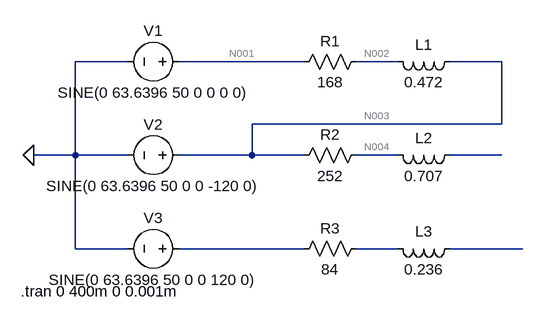
[diagram p0: schematic scheme4.asc]
scheme4.asc, the LTspice schematic file:
Version 4
SHEET 1 964 680
WIRE 352 0 272 0
WIRE 624 0 432 0
WIRE 768 0 704 0
WIRE 928 0 848 0
WIRE 928 96 928 0
WIRE 928 96 544 96
WIRE 272 144 272 0
WIRE 272 144 208 144
WIRE 352 144 272 144
WIRE 544 144 544 96
WIRE 544 144 432 144
WIRE 624 144 544 144
WIRE 768 144 704 144
WIRE 928 144 848 144
WIRE 272 288 272 144
WIRE 352 288 272 288
WIRE 624 288 432 288
WIRE 768 288 704 288
WIRE 960 288 848 288
FLAG 208 144 0
SYMBOL voltage 448 0 R90
WINDOW 0 -32 56 VBottom 2
WINDOW 3 32 56 VTop 2
WINDOW 123 0 0 Left 0
WINDOW 39 0 0 Left 0
SYMATTR InstName V1
SYMATTR Value SINE(0 63.6396 50 0 0 0 0)
SYMBOL voltage 448 144 R90
WINDOW 0 -32 56 VBottom 2
WINDOW 3 32 56 VTop 2
WINDOW 123 0 0 Left 0
WINDOW 39 0 0 Left 0
SYMATTR InstName V2
SYMATTR Value SINE(0 63.6396 50 0 0 -120 0)
SYMBOL voltage 448 288 R90
WINDOW 0 -32 56 VBottom 2
WINDOW 3 32 56 VTop 2
WINDOW 123 0 0 Left 0
WINDOW 39 0 0 Left 0
SYMATTR InstName V3
SYMATTR Value SINE(0 63.6396 50 0 0 120 0)
SYMBOL res 720 -16 R90
WINDOW 0 0 56 VBottom 2
WINDOW 3 32 56 VTop 2
SYMATTR InstName R1
SYMATTR Value 168
SYMBOL ind 864 -16 R90
WINDOW 0 5 56 VBottom 2
WINDOW 3 32 56 VTop 2
SYMATTR InstName L1
SYMATTR Value 0.472
SYMBOL ind 864 128 R90
WINDOW 0 5 56 VBottom 2
WINDOW 3 32 56 VTop 2
SYMATTR InstName L2
SYMATTR Value 0.707
SYMBOL ind 864 272 R90
WINDOW 0 5 56 VBottom 2
WINDOW 3 32 56 VTop 2
SYMATTR InstName L3
SYMATTR Value 0.236
SYMBOL res 720 128 R90
WINDOW 0 0 56 VBottom 2
WINDOW 3 32 56 VTop 2
SYMATTR InstName R2
SYMATTR Value 252
SYMBOL res 720 272 R90
WINDOW 0 0 56 VBottom 2
WINDOW 3 32 56 VTop 2
SYMATTR InstName R3
SYMATTR Value 84
TEXT 188 354 Left 2 !.tran 0 400m 0 0.001m

The netlist it stands for:
* scheme4.asc
V1 N001 0 SINE(0 63.6396 50 0 0 0 0)
V2 N003 0 SINE(0 63.6396 50 0 0 -120 0)
V3 N006 0 SINE(0 63.6396 50 0 0 120 0)
R1 N002 N001 168
L1 N003 N002 0.472
L2 N005 N004 0.707
L3 N008 N007 0.236
R2 N004 N003 252
R3 N007 N006 84
.tran 0 400m 0 0.001m
.backanno
.end

* Results of the author's LTspice run, read from the files saved beside the schematic
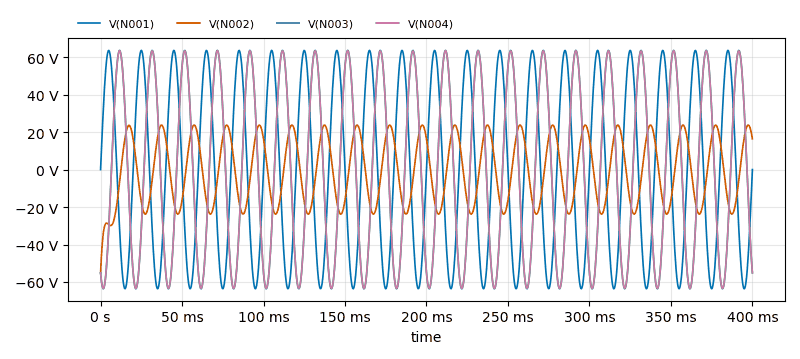
[diagram p1: Transient Analysis of scheme4.asc, plotted from the saved traces]
* Transient Analysis, 1 run:
*   V(N001): min -63.64 V, max 63.64 V, average -10.52 µV, rms 45 V, last 0 V
*   V(N002): min -55.11 V, max 23.77 V, average -504.4 mV, rms 17.32 V, last 16.42 V
*   V(N003): min -63.64 V, max 63.64 V, average -86.3 µV, rms 45 V, last -55.11 V
*   V(N004): min -63.48 V, max 63.48 V, average -507.8 µV, rms 44.84 V, last -55.11 V